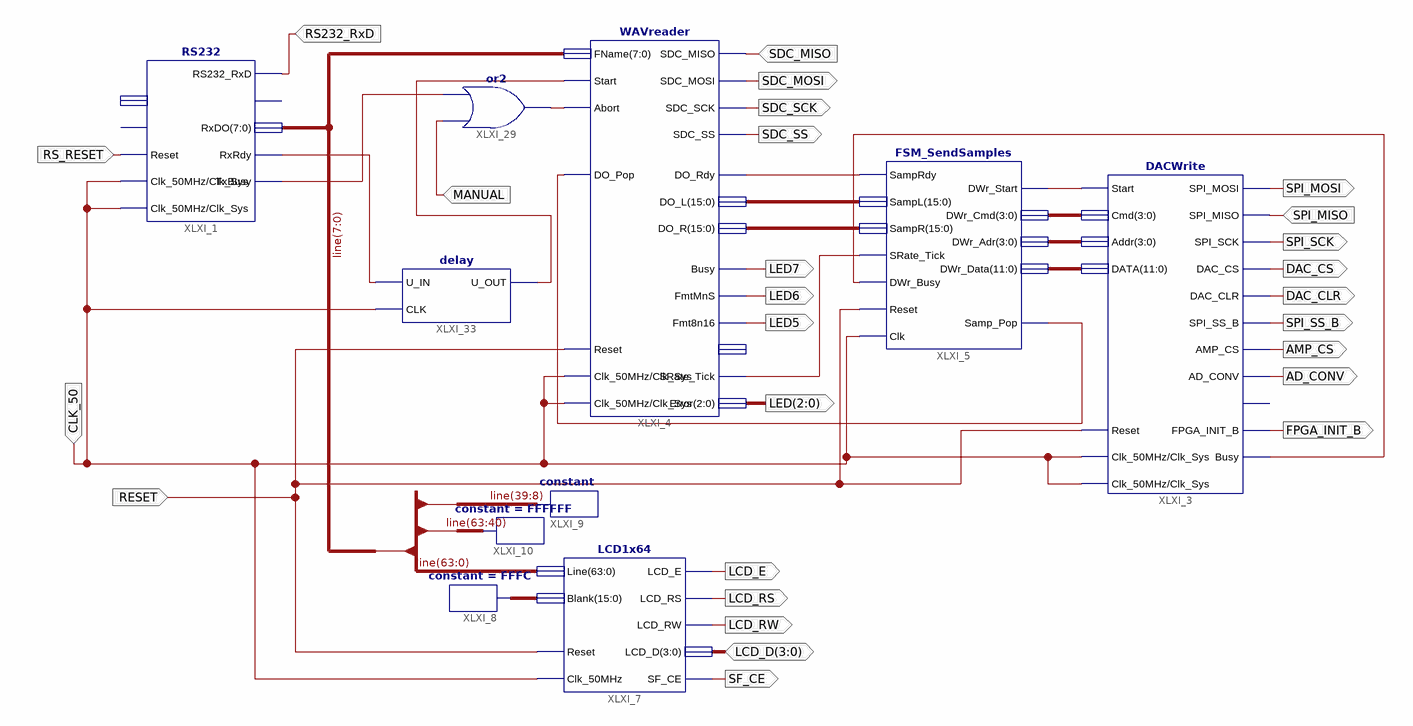
[diagram p0: schematic sheet 1]
// Xilinx ISE schematic Syntezator.sch (spartan3e) as structural Verilog: 10 symbols, 27 ports
module Syntezator (
  input  RS_RESET,
  input  CLK_50,
  input  RS232_RxD,
  input  SDC_MISO,
  input  SPI_MISO,
  input  RESET,
  input  MANUAL,
  inout  [3:0] LCD_D,
  output SDC_MOSI,
  output SDC_SCK,
  output SDC_SS,
  output LED7,
  output LED6,
  output LED5,
  output [2:0] LED,
  output SPI_MOSI,
  output SPI_SCK,
  output DAC_CS,
  output DAC_CLR,
  output SPI_SS_B,
  output AMP_CS,
  output AD_CONV,
  output FPGA_INIT_B,
  output LCD_E,
  output LCD_RS,
  output LCD_RW,
  output SF_CE
);

  wire XLXN_17, XLXN_24, XLXN_25, XLXN_26, XLXN_49, XLXN_77, XLXN_78, XLXN_82, XLXN_83;
  wire [3:0] XLXN_50, XLXN_51;
  wire [11:0] XLXN_52;
  wire [15:0] XLXN_18, XLXN_19, XLXN_56;
  wire [63:0] line;

  RS232 XLXI_1 (
    .Clk_50MHz(CLK_50), .Reset(RS_RESET), .RS232_RxD(RS232_RxD), .TxBusy(XLXN_78), .RxRdy(XLXN_83),
    .RxDO(line[7:0]), .Clk_Sys(CLK_50));  // open: TxStart, TxDI, RS232_TxD
  DACWrite XLXI_3 (
    .Reset(RESET), .Start(XLXN_49), .SPI_MISO(SPI_MISO), .Cmd(XLXN_50), .Addr(XLXN_51), .DATA(XLXN_52),
    .DAC_CLR(DAC_CLR), .DAC_CS(DAC_CS), .SPI_MOSI(SPI_MOSI), .SPI_SCK(SPI_SCK), .SPI_SS_B(SPI_SS_B),
    .AMP_CS(AMP_CS), .AD_CONV(AD_CONV), .FPGA_INIT_B(FPGA_INIT_B), .Busy(XLXN_26), .Clk_50MHz(CLK_50),
    .Clk_Sys(CLK_50));  // open: SF_CE0
  WAVreader XLXI_4 (
    .FName(line[7:0]), .Start(XLXN_82), .Abort(XLXN_77), .SDC_MOSI(SDC_MOSI), .SDC_SCK(SDC_SCK),
    .SDC_SS(SDC_SS), .SDC_MISO(SDC_MISO), .DO_Pop(XLXN_25), .FmtMnS(LED6), .Fmt8n16(LED5),
    .SRate_Tick(XLXN_24), .Error(LED), .Reset(RESET), .Clk_50MHz(CLK_50), .Clk_Sys(CLK_50), .DO_Rdy(XLXN_17),
    .DO_L(XLXN_18), .DO_R(XLXN_19), .Busy(LED7));  // open: FmtSRate
  FSM_SendSamples XLXI_5 (
    .Clk(CLK_50), .Reset(RESET), .SRate_Tick(XLXN_24), .SampRdy(XLXN_17), .DWr_Busy(XLXN_26),
    .SampL(XLXN_18), .SampR(XLXN_19), .Samp_Pop(XLXN_25), .DWr_Start(XLXN_49), .DWr_Cmd(XLXN_50),
    .DWr_Adr(XLXN_51), .DWr_Data(XLXN_52));
  LCD1x64 XLXI_7 (
    .Clk_50MHz(CLK_50), .Reset(RESET), .Line(line), .Blank(XLXN_56), .LCD_D(LCD_D), .LCD_E(LCD_E),
    .LCD_RW(LCD_RW), .LCD_RS(LCD_RS), .SF_CE(SF_CE));
  constant #(.CValue("FFFC")) XLXI_8 (.O(XLXN_56));
  constant XLXI_9 (.O(line[39:8]));
  constant #(.CValue("FFFFFF")) XLXI_10 (.O(line[63:40]));
  or XLXI_29 (XLXN_77, MANUAL, XLXN_78);
  delay XLXI_33 (.U_IN(XLXN_83), .CLK(CLK_50), .U_OUT(XLXN_82));
endmodule
